# EAGLE design PennyMan_Ard_R3_Shield_v9.5 (EAGLE 9.1.3)
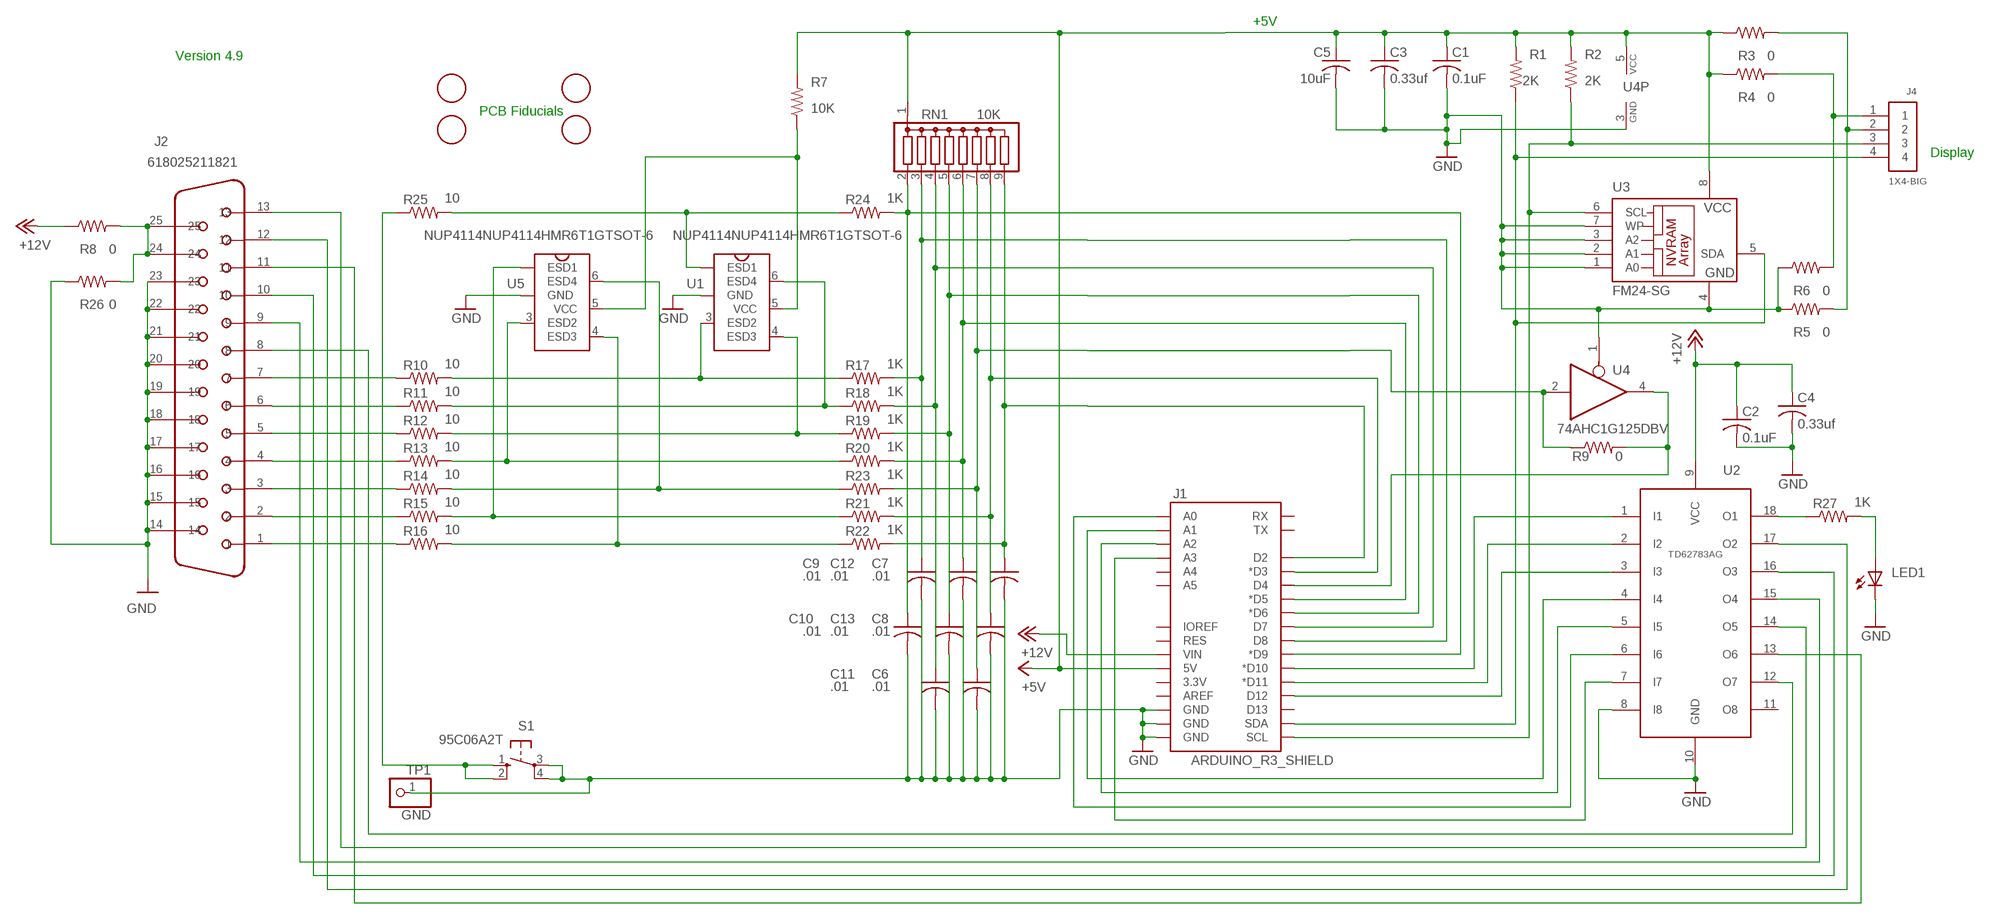
[diagram p0: schematic, sheet 1]

## Parts
C1  0.1uF  C-USC0805  [C0805]
C2  0.1uF  C-USC0805  [C0805]
C3  0.33uf  C-USC1206  [C1206]
C4  0.33uf  C-USC1206  [C1206]
C5  10uF  C-USC1812  [C1812]
C6  .01  C-USC0805  [C0805]
C7  .01  C-USC0805  [C0805]
C8  .01  C-USC0805  [C0805]
C9  .01  C-USC0805  [C0805]
C10  .01  C-USC0805  [C0805]
C11  .01  C-USC0805  [C0805]
C12  .01  C-USC0805  [C0805]
C13  .01  C-USC0805  [C0805]
GND  TP1  PINHD-1X1  [1X01]
J1  ARDUINO_R3_SHIELD  [UNO_R3_SHIELD]
J2  618025211821  [618025211821]
J4  1X4-BIG  [1X04-BIG]
LED1  LEDSMT1206  [1206]
R1  2K  R-US_R0805  [R0805]
R2  2K  R-US_R0805  [R0805]
R3  0  R-US_R0805  [R0805]
R4  0  R-US_R0805  [R0805]
R5  0  R-US_R0805  [R0805]
R6  0  R-US_R0805  [R0805]
R7  10K  R-US_R0805  [R0805]
R8  0  R-US_R0805  [R0805]
R9  0  R-US_R0805  [R0805]
R10  10  R-US_M0805  [M0805]
R11  10  R-US_M0805  [M0805]
R12  10  R-US_M0805  [M0805]
R13  10  R-US_M0805  [M0805]
R14  10  R-US_M0805  [M0805]
R15  10  R-US_M0805  [M0805]
R16  10  R-US_M0805  [M0805]
R17  1K  R-US_M0805  [M0805]
R18  1K  R-US_M0805  [M0805]
R19  1K  R-US_M0805  [M0805]
R20  1K  R-US_M0805  [M0805]
R21  1K  R-US_M0805  [M0805]
R22  1K  R-US_M0805  [M0805]
R23  1K  R-US_M0805  [M0805]
R24  1K  R-US_M0805  [M0805]
R25  10  R-US_M0805  [M0805]
R26  0  R-US_R0805  [R0805]
R27  1K  R-US_M0805  [M0805]
RN1  10K  G08R  [SIL9]
S1  95C06A2T  10-XX  [B3F-10XX]
U1  NUP4114NUP4114HMR6T1GTSOT-6  [TSOT-23-6]
U2  TD62783AG  [SOP18]
U3  FM24-SG  [SO8]
U4  74AHC1G125DBV  [SOT23-5]
U5  NUP4114NUP4114HMR6T1GTSOT-6  [TSOT-23-6]
U$1  FIDUCIAL  [FIDUCIAL_1MM]
U$2  FIDUCIAL  [FIDUCIAL_1MM]
U$3  FIDUCIAL  [FIDUCIAL_1MM]
U$4  FIDUCIAL  [FIDUCIAL_1MM]

## Nets
+5V: C1.1 C3.1 C5.1 J1.5V R1.2 R2.2 R3.1 R4.1 R7.2 RN1.1 U3.8(VCC) U4.5(VCC)
+12V: C2.1 C4.1 J1.VIN R8.1 U2.9(VCC)
GND: C1.2 C2.2 C3.2 C4.2 C5.2 C6.2 C7.2 C8.2 C9.2 C10.2 C11.2 C12.2 C13.2 GND.1 J1.GND@0(GND) J1.GND@1(GND) J1.GND@2(GND) J2.14 J2.15 J2.16 J2.17 J2.18 J2.19 J2.20 J2.21 J2.22 J2.23 LED1.C R5.1 R6.1 R26.1 S1.3(P) S1.4(P1) U1.2(GND) U2.8(I8) U2.10(GND) U3.1(A0) U3.2(A1) U3.3(A2) U3.4(GND) U3.7(WP) U4.1(OE) U4.3(GND) U5.2(GND)
N$1: C7.1 J1.D2 R22.2 RN1.9
N$2: C8.1 J1.D3(*D3) R21.2 RN1.8
N$3: C6.1 R9.1 R23.2 RN1.7 U4.2(I)
N$4: C9.1 J1.D5(*D5) R20.2 RN1.6
N$5: C10.1 J1.D6(*D6) R19.2 RN1.5
N$6: C11.1 J1.D7 R18.2 RN1.4
N$7: C12.1 J1.D8 R17.2 RN1.3
N$8: R24.1 R25.2 U1.1(ESD1)
N$9: R10.2 R17.1 U1.3(ESD2)
N$10: R11.2 R18.1 U1.6(ESD4)
N$11: R12.2 R19.1 U1.4(ESD3)
N$12: R13.2 R20.1 U5.3(ESD2)
N$13: R25.1 S1.1(S) S1.2(S1)
N$14: R14.2 R23.1 U5.6(ESD4)
N$15: R7.1 U1.5(VCC) U5.5(VCC)
N$16: R15.2 R21.1 U5.1(ESD1)
N$17: J1.A0 U2.6(I6)
N$18: J1.D10(*D10) U2.1(I1)
N$19: J1.D11(*D11) U2.2(I2)
N$20: J1.D12 U2.3(I3)
N$21: J1.A1 U2.4(I4)
N$22: J2.12 U2.17(O2)
N$23: J2.10 U2.16(O3)
N$24: J2.9 U2.15(O4)
N$25: R16.2 R22.1 U5.4(ESD3)
N$26: J1.SCL J4.3 R2.1 U3.6(SCL)
N$27: J2.13 U2.14(O5)
N$28: J4.1 R4.2 R6.2
N$29: J1.SDA J4.4 R1.1 U3.5(SDA)
N$30: J4.2 R3.2 R5.2
N$31: J1.D4 R9.2 U4.4(O)
N$32: J1.A2 U2.5(I5)
N$33: R27.1 U2.18(O1)
N$34: J2.11 U2.13(O6)
N$35: LED1.A R27.2
N$36: J1.A3 U2.7(I7)
N$37: J2.8 U2.12(O7)
N$38: J2.24 J2.25 R8.2 R26.2
N$39: J2.6 R11.1
N$42: J2.4 R13.1
N$44: J2.2 R15.1
N$46: J2.1 R16.1
N$48: J2.3 R14.1
N$50: J2.5 R12.1
N$52: J2.7 R10.1
N$53: C13.1 J1.D9(*D9) R24.2 RN1.2
Unconnected: J1.3.3V J1.A4 J1.A5 J1.AREF J1.D13 J1.IOREF J1.RES J1.RX J1.TX U2.11(O8)

## Notes on the sheet
- +5V
- Version 4.9
- PCB Fiducials
- Display

## Library data of the parts
C1-C5 = resistor:C-US: CAPACITOR, American symbol
C6-C13 = adafruit:C-US: CAPACITOR, American symbol
GND = adafruit:PINHD-1X1: Pin header 1x1 for 0.1" spacing With round pins
J1 = SparkFun-Boards:ARDUINO_R3_SHIELD: Shield form compatible with the Arduino Uno R3.
J2 = EagleLibrary_Wuerth_Elektronik_eiCan_Communication_Connectors_v4_20150113:618025211821: WR-DSUB 8.08mm Female Angled PCB Connector without Hex Screw, 25 Pins=>Code : Con_I-O_DSUB_PCB_Female_wo-screw_618025211821 <http://katalog.we-online.de/media/images/eican/Con_I-O_DSUB_PCB_Female_wo-screw_6180xx211821_pf2.jpg> Details see: http://katalog.we-online.de/en/em/618_0xx_211_821 Created 2014-07-10, Karrer Zheng 2014 (C) Würth Elektronik
J4 = adafruit:1X4: 4-pin connector
LED1 = adafruit:LED: LED OSRAM: - CHIPLED LG R971, LG N971, LY N971, LG Q971, LY Q971, LO R971, LY R971 LH N974, LH R974 LS Q976, LO Q976, LY Q976 LO Q996 - Hyper CHIPLED LW Q18S LB Q993, LB Q99A, LB R99A - SideLED LS A670, LO A670, LY A670, LG A670, LP A670 LB A673, LV A673, LT A673, LW A673 LH A674 LY A675 LS A676, LA A676, LO A676, LY A676, LW A676 LS A679, LY A679, LG A679 - Hyper Micro SIDELED® LS Y876, LA Y876, LO Y876, LY Y876 LT Y87S - SmartLED LW L88C, LW L88S LB L89C, LB L89S, LG L890 LS L89K, LO L89K, LY L89K LS L896, LA L896, LO L896, LY L896 - TOPLED LS T670, LO T670, LY T670, LG T670, LP T670 LSG T670, LSP T670, LSY T670, LOP T670, LYG T670 LG T671, LOG T671, LSG T671 LB T673, LV T673, LT T673, LW T673 LH T674 LS T676, LA T676, LO T676, LY T676, LB T676, LH T676, LSB T676, LW T676 LB T67C, LV T67C, LT T67C, LS T67K, LO T67K, LY T67K, LW E67C LS E67B, LA E67B, LO E67B, LY E67B, LB E67C, LV E67C, LT E67C LW T67C LS T679, LY T679, LG T679 LS T770, LO T770, LY T770, LG T770, LP T770 LB T773, LV T773, LT T773, LW T773 LH T774 LS E675, LA E675, LY E675, LS T675 LS T776, LA T776, LO T776, LY T776, LB T776 LHGB T686 LT T68C, LB T68C - Hyper Mini TOPLED® LB M676 - Mini TOPLED Santana® LG M470 LS M47K, LO M47K, LY M47K Source: http://www.osram.convergy.de/
R1-R27 = resistor:R-US_: RESISTOR, American symbol
RN1 = resistor-sil:G08R: SIL RESISTOR; OC_FARNELL: unknown; OC_NEWARK: unknown
S1 = switch-omron:10-XX: OMRON SWITCH
U1 U5 = TSOT-23-6:NUP4114: On Semiconductor ESD Diode Array - Quad
U2 = NDN:TD62783AG: Octal High-side driver
U3 = ramtron:FM24*: I2C NVRAM 8 pin
U4 = 74xx-little-us:74*1G125: Single Bus Buffer Gate with 3-State Output
U$1-U$4 = adafruit:FIDUCIAL: For use by pick and place machines to calibrate the vision/machine, 1mm By microbuilder.eu

## Net classes
0 default: clearance 0.205 mm

## Board
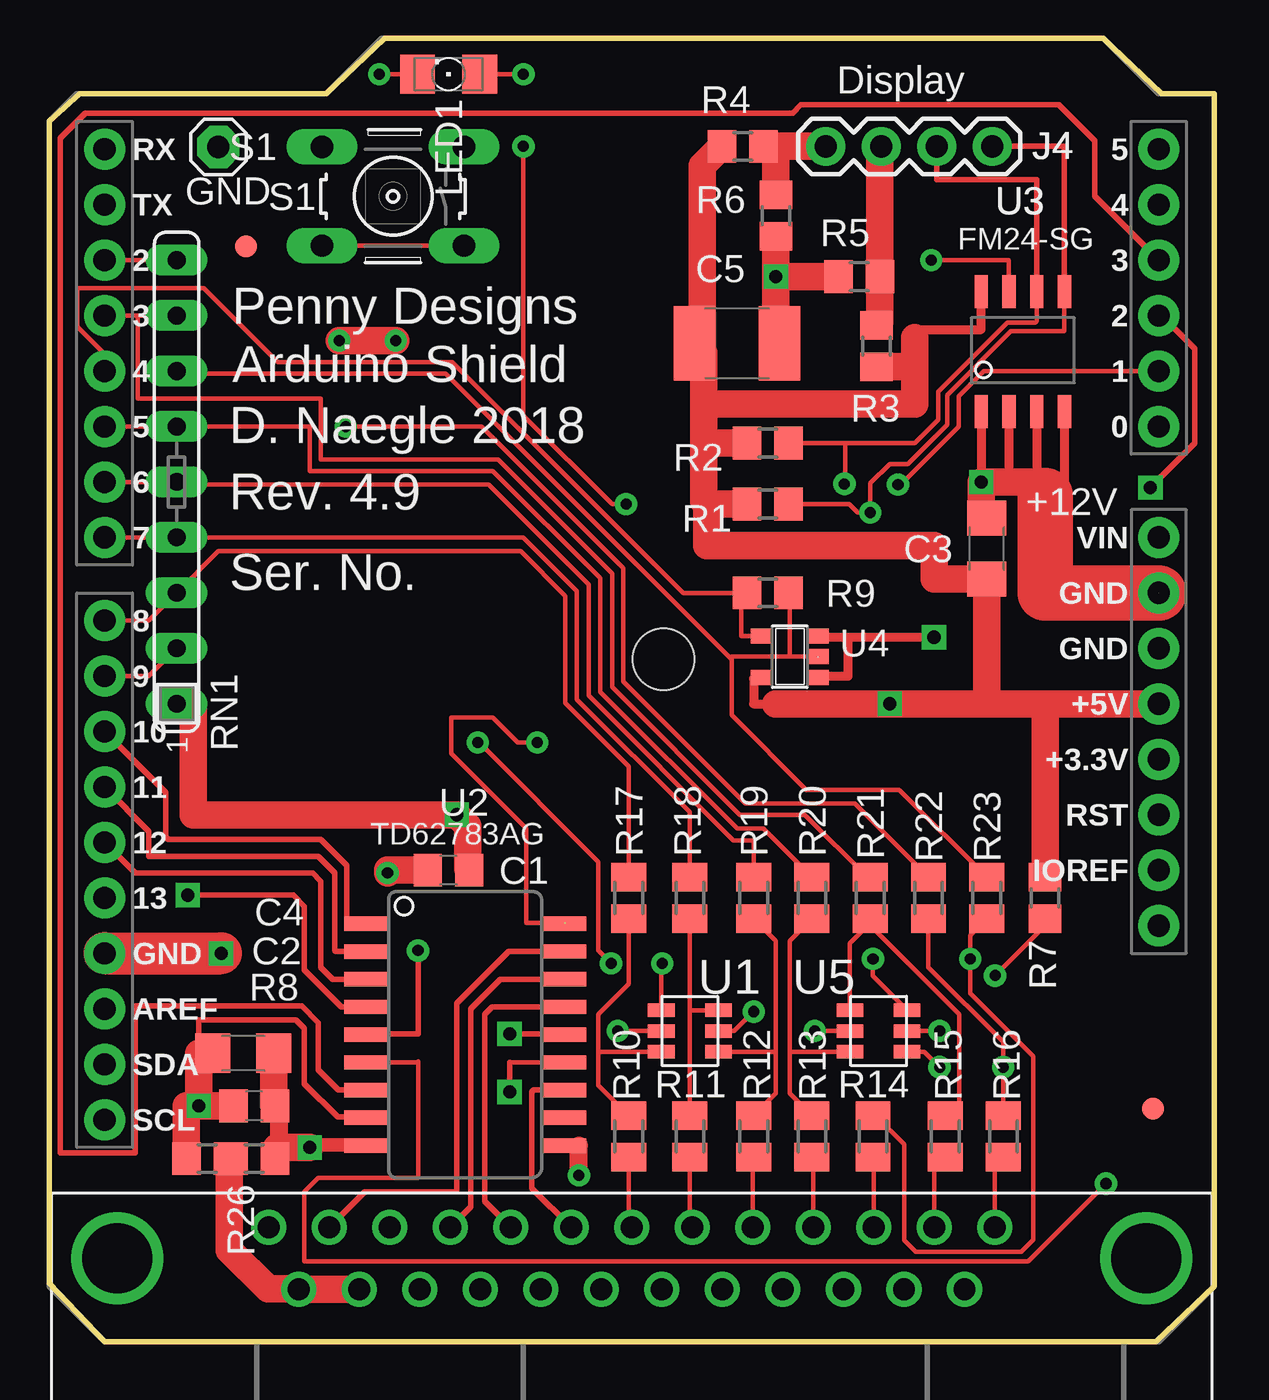
[diagram p1: board, top side]
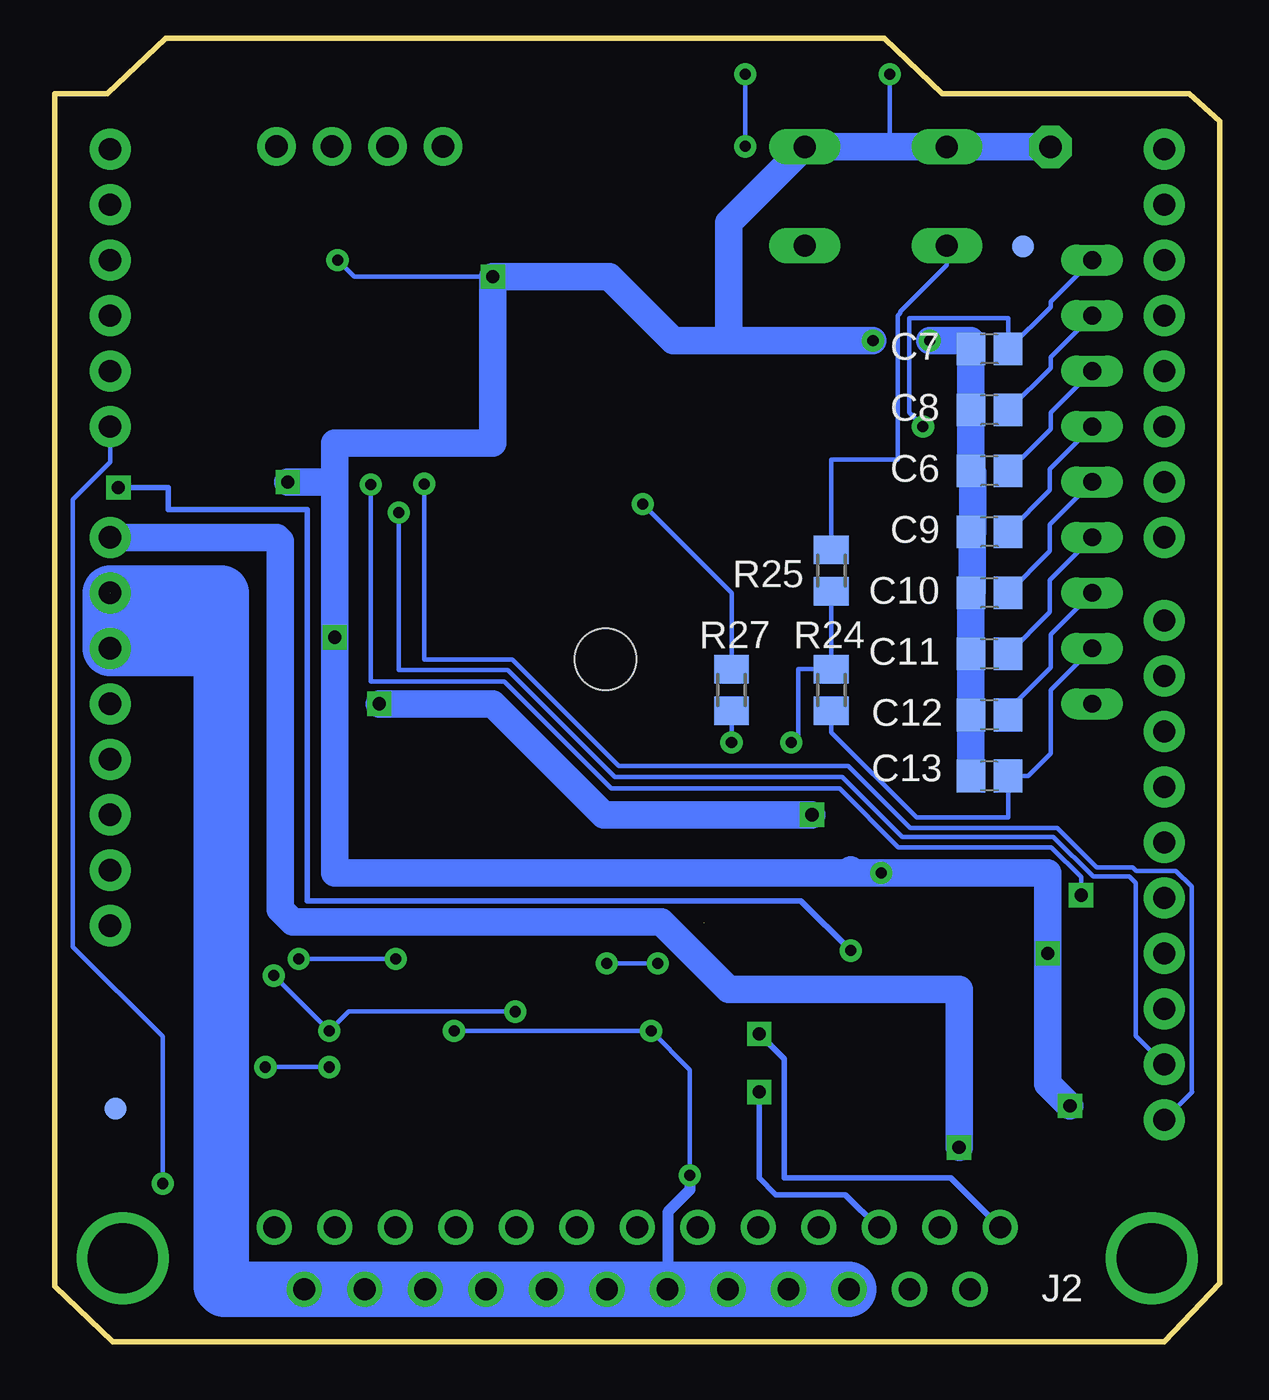
[diagram p2: board, bottom side, seen from below]

No outline drawn. Coordinates in mm, seen from the top.
Copper layers (1*16): Top 0.035mm / dielectric 1.5mm / Bottom 0.035mm
Design rules "SparkFun *": minimum track width 8mil, minimum drill 20mil, track to track 8mil, track to pad 8mil, pad to pad 8mil, via to via 8mil, smd to smd 8mil, copper to edge 10mil, drill to drill 8mil, minimum pad ring 12mil, minimum via ring 10mil, stop-mask expansion 0mil, vias tented up to drill 25mil, thermal gap 10mil
Holes 2.8 mm at 28,31.25

### Footprints (pad centres in the part's own frame; a part is rotated, then mirrored left to right if it is on the bottom)
C0805 = smd 1.3 x 1.5: 1 -0.95,0; 2 0.95,0
C1206 = smd 1.6 x 1.8: 1 -1.4,0; 2 1.4,0
C1812 = smd 1.9 x 3.4: 1 -1.95,0; 2 1.95,0
C0805' = smd 1.3 x 1.5: 1 -0.85,0; 2 0.85,0
1X01 = drill 1.016 pad 1.93 octagon: 1 0,0
UNO_R3_SHIELD = drill 1.016 pad 1.88: 3.3V 50.8,26.67; 5V 50.8,29.21; A0 50.8,41.91; A1 50.8,44.45; A2 50.8,46.99; A3 50.8,49.53; A4 50.8,52.07; A5 50.8,54.61; AREF 2.54,15.24; D2 2.54,49.53; D3 2.54,46.99; D4 2.54,44.45; D5 2.54,41.91; D6 2.54,39.37; D7 2.54,36.83; D8 2.54,33.02; D9 2.54,30.48; D10 2.54,27.94; D11 2.54,25.4; D12 2.54,22.86; D13 2.54,20.32; GND@0 50.8,31.75; GND@1 50.8,34.29; GND@2 2.54,17.78; IOREF 50.8,21.59; NC 50.8,19.05; RES 50.8,24.13; RX 2.54,54.61; SCL 2.54,10.16; SDA 2.54,12.7; TX 2.54,52.07; VIN 50.8,36.83
618025211821 = drill 1: 1 16.62,1.42; 2 13.85,1.42; 3 11.08,1.42; 4 8.31,1.42; 5 5.54,1.42; 6 2.77,1.42; 7 0,1.42; 8 -2.77,1.42; 9 -5.54,1.42; 10 -8.31,1.42; 11 -11.08,1.42; 12 -13.85,1.42; 13 -16.62,1.42; 14 15.235,-1.42; 15 12.465,-1.42; 16 9.695,-1.42; 17 6.925,-1.42; 18 4.155,-1.42; 19 1.385,-1.42; 20 -1.385,-1.42; 21 -4.155,-1.42; 22 -6.925,-1.42; 23 -9.695,-1.42; 24 -12.465,-1.42; 25 -15.235,-1.42 | drill 3.2: Z1 -23.55,0; Z2 23.55,0
1X04-BIG = drill 1.016 pad 1.778: 1 0,0; 2 2.54,0; 3 5.08,0; 4 7.62,0
1206 = smd 1.6 x 1.803: A -1.422,0; C 1.422,0
R0805 = smd 1.3 x 1.5: 1 -0.95,0; 2 0.95,0
M0805 = smd 1.3 x 1.6: 1 -0.95,0; 2 0.95,0
SIL9 = drill 0.813 long: 1 -10.16,0; 2 -7.62,0; 3 -5.08,0; 4 -2.54,0; 5 0,0; 6 2.54,0; 7 5.08,0; 8 7.62,0; 9 10.16,0
B3F-10XX = drill 1.016 long: 1 -3.251,2.261; 2 3.251,2.261; 3 -3.251,-2.261; 4 3.251,-2.261
TSOT-23-6 = smd 0.622 x 1.22: 1 -0.95,-1.31; 2 0,-1.31; 3 0.95,-1.31; 4 0.95,1.31; 5 0,1.31; 6 -0.95,1.31
SOP18 = smd 0.66 x 2.032: 1 -3.9,-4.525; 2 -2.625,-4.525; 3 -1.36,-4.525; 4 -0.09,-4.525; 5 1.18,-4.525; 6 2.45,-4.525; 7 3.72,-4.525; 8 4.99,-4.525; 9 6.26,-4.525; 10 6.26,4.525; 11 4.99,4.525; 12 3.72,4.525; 13 2.45,4.525; 14 1.18,4.525; 15 -0.09,4.525; 16 -1.36,4.525; 17 -2.63,4.525; 18 -3.9,4.525
SO8 = smd 0.61 x 1.524: 1 -1.27,-2.743; 2 0,-2.743; 3 1.27,-2.743; 4 2.54,-2.743; 5 2.54,2.743; 6 1.27,2.743; 7 0,2.743; 8 -1.27,2.743
SOT23-5 = smd 0.69 x 0.99: 1 -0.95,-1.29; 2 0,-1.29; 3 0.95,-1.29; 4 0.95,1.3; 5 -0.95,1.3
FIDUCIAL_1MM = smd 1 x 1: 1 0,0

### Placement (x,y rotation side)
C1  18.16,21.59 180 top
C2  9.27,10.79 180 top
C3  42.8,36.32 90 top
C4  8.76,13.21 180 top
C5  31.37,45.72 0 top
C6  .01  [C0805']  10.41,39.88 180 bottom
C7  .01  [C0805']  10.41,45.47 180 bottom
C8  .01  [C0805']  10.41,42.67 180 bottom
C9  .01  [C0805']  10.41,37.08 180 bottom
C10  .01  [C0805']  10.41,34.29 180 bottom
C11  .01  [C0805']  10.41,31.5 180 bottom
C12  .01  [C0805']  10.41,28.7 180 bottom
C13  .01  [C0805']  10.41,25.91 180 bottom
GND  7.62,54.71 0 top
J1  -0.13,0 0 top
J2  26.54,3.81 0 top
J4  35.43,54.74 0 top
LED1  18.16,58.04 180 top
R1  32.77,38.35 180 top
R2  32.77,41.15 180 top
R3  37.75,45.59 90 top
R4  31.62,54.74 0 top
R5  36.96,48.77 0 top
R6  33.15,51.56 90 top
R7  45.47,20.32 90 top
R8  9.27,8.38 180 top
R9  32.77,34.29 180 top
R10  26.42,9.4 90 top
R11  29.21,9.4 90 top
R12  32.13,9.4 90 top
R13  34.8,9.4 90 top
R14  37.59,9.4 90 top
R15  40.89,9.4 90 top
R16  43.56,9.4 90 top
R17  26.42,20.32 90 top
R18  29.21,20.32 90 top
R19  32.13,20.32 90 top
R20  34.8,20.32 90 top
R21  37.47,20.32 90 top
R22  40.13,20.32 90 top
R23  42.8,20.32 90 top
R24  17.65,29.84 270 bottom
R25  17.65,35.31 270 bottom
R26  7.11,8.38 0 top
R27  22.23,29.84 90 bottom
RN1  5.71,39.37 90 top
S1  15.62,52.45 180 top
U1  29.21,14.22 270 top
U2  18.92,15.24 270 top
U3  43.81,45.34 0 top
U4  33.78,31.37 90 top
U5  37.85,14.22 270 top
U$1  50.42,10.67 0 top
U$2  8.89,50.16 0 top
U$3  50.42,10.67 0 bottom
U$4  8.89,50.16 0 bottom

### Tracks (layer width: path | path; a pad name or v marks a point on that pad's centre or on a via)
+5V  (via drill 0.6)
  Top 0.203: 45.47,29.08 45.59,29.21
  Top 0.254: 39.55,46.35 39.55,46.02 39.5,45.97 | 32.13,30.35 32.48,30.35 | 30.61,38.35 29.97,38.35
  Top 0.406: 39.55,46.35 42.55,46.35 U3.8 | 32.13,30.35 32.13,29.21 33.15,29.21 | 32.48,30.35 U4.5
  Top 1.27: J1.5V 45.59,29.21 42.8,29.21 | 42.8,29.21 C3.1 40.39,34.92 40.39,36.45 29.97,36.45 29.97,38.35 29.84,38.48 29.84,41.15 | 42.8,29.21 v38.35,29.21 33.15,29.21 | 39.5,45.97 39.5,44.58 | 39.5,44.58 39.5,42.93 29.97,42.93 29.84,43.05 | R1.2 30.61,38.35 | R3.1 39.43,44.64 39.5,44.58 | RN1.1 6.22,29.21 arc-90 6.48,28.96 6.48,24.13 v18.54,24.13 19.05,23.62 19.05,21.65 C1.1 | R7.2 45.47,25.91 | 45.47,25.91 45.47,29.08 | 45.47,25.91 | R4.1 29.78,53.85 29.78,45.72 C5.1 29.84,45.29 29.84,43.05 | 29.84,43.05 29.84,41.15 | 29.84,41.15 R2.2
  Bottom 1.27: v38.35,29.21 33.15,29.21 28.07,24.13 v18.54,24.13
+12V  (via drill 0.6)
  Top 0.254: 14.4,9.02 U2.9 | R8.1 10.29,8.45 10.29,8.89
  Top 0.61: 14.4,9.02 11.94,9.02 v11.81,8.89
  Top 0.813: 11.94,9.02 10.41,9.02 10.41,10.79 C2.1
  Top 1.27: 10.29,8.89 v11.81,8.89 | C2.1 10.16,10.79 C4.1
  Bottom 1.27: J1.VIN 43.05,36.83 42.88,36.65 42.88,19.79 42.31,19.23 25.45,19.23 22.35,16.13 11.81,16.13 v11.81,8.89
GND  (via drill 0.51, 0.6)  (1 unrouted)
  Top 0.203: U1.2 v25.91,14.22 | U5.2 v34.92,14.22 | U3.7 43.81,49.53 v40.26,49.53 | LED1.C v14.99,58.04
  Top 0.254: 14.36,10.29 13.08,10.29 11.56,11.81 11.56,14.35 11.18,14.73 6.73,14.73 6.73,13.21 | 35.31,32.26 35.07,32.26 U4.3 | U4.1 34.99,30.42 arc90 35.05,30.48
  Top 0.406: U3.1 v42.55,39.37 | U3.2 43.81,39.37 | U3.3 45.09,39.37 | U3.4 46.35,39.37 45.47,39.37 | 35.31,32.26 36.45,32.26 | 36.45,32.26 v40.39,32.26 | 35.05,30.48 36.45,30.48 36.45,32.26
  Top 0.61: U2.10 24.13,8.98
  Top 0.635: U2.8 14.36,10.29
  Top 0.813: v24.13,7.62 24.13,8.98
  Top 1.27: C3.2 42.54,37.72 v42.54,39.37 v42.55,39.37 43.81,39.37 45.09,39.37 45.47,39.37 45.47,38.73 | R6.1 v33.15,48.77 | v33.15,48.77 R5.1 | C5.2 33.15,45.72 v33.15,48.77 | v6.73,10.79 6.73,13.21 C4.2 | v15.75,45.85 v13.15,45.85 | C1.2 15.37,21.59 v15.37,21.46 | v6.73,10.79 C2.2 | R26.1 6.16,10.79 v6.73,10.79
  Top 1.93: J1.GND@2 v7.75,17.78
  Top 2.54: J1.GND@1 48.26,34.29 45.47,34.29 45.47,38.73
  Bottom 0.203: C9.2 11.18,37.08 | v24.13,7.62 24.13,12.45 v25.91,14.22 29.34,14.22 | v34.92,14.22 29.34,14.22 | 29.34,14.22 | 29.34,14.22 | 29.34,14.22 | 29.34,14.22 | 29.34,14.22 | 29.34,14.22 | v40.26,49.53 39.5,48.77 v33.15,48.77 | v14.99,58.04 14.99,54.71 S1.4
  Bottom 0.406: 45.44,2.39 45.59,2.54
  Bottom 0.508: v24.13,7.62 24.13,6.95 25.14,5.94 25.14,2.41 J2.20
  Bottom 1.27: 40.39,39.37 v40.39,32.26 40.39,21.46 23.5,21.46 16.89,21.46 16.76,21.59 16.64,21.46 v15.37,21.46 7.75,21.46 v7.75,17.78 7.75,11.81 v6.73,10.79 | 40.39,39.37 40.39,41.15 33.15,41.15 v33.15,48.77 27.81,48.77 24.89,45.85 22.35,45.85 | 40.39,39.37 v42.54,39.37 | 11.18,37.08 11.18,39.79 C6.2 C8.2 C7.2 11.26,45.85 v13.15,45.85 | C13.2 C12.2 C11.2 C10.2 11.2,34.35 11.2,37.08 C9.2 | 22.35,45.85 v15.75,45.85 | GND.1 14.99,54.71 S1.3 22.35,51.23 22.35,46.99 22.35,45.85
  Bottom 2.54: 45.59,31.75 J1.GND@0 J1.GND@1 45.59,34.29 45.59,31.75 | J2.23 J2.22 J2.21 J2.20 J2.19 J2.18 J2.17 J2.16 36.33,2.39 37.22,2.39 J2.15 39.19,2.39 J2.14 45.44,2.39 | 45.59,2.54 45.59,31.75
N$1  (via drill 0.51)
  Top 0.203: R22.2 36.76,24.64 31.75,24.64 26.16,30.23 26.16,35.43 19.68,41.91 14.1,41.91 14.48,41.91 v13.46,41.91 | J1.D2 RN1.9
  Bottom 0.203: v13.46,41.91 14.1,42.55 14.1,46.86 9.56,46.86 C7.1 9.53,45.47 7.62,47.37 7.62,47.62 RN1.9
N$2
  Top 0.203: RN1.8 3.94,46.99 | 3.94,46.99 J1.D3 | 3.94,46.99 3.94,43.18 12.32,43.18 12.32,40.39 20.45,40.39 25.65,35.18 25.65,29.97 31.5,24.13 34.48,24.13 37.34,21.27 R21.2
  Bottom 0.203: C8.1 9.53,42.67 7.62,44.58 7.62,45.09 RN1.8
N$3
  Top 0.203: U4.2 33.78,31.37 | 33.78,31.37 33.78,34.22 R9.1 | R23.2 38.8,25.27 34.54,25.27 31.11,28.7 31.11,31.24 | 31.11,31.24 31.11,31.37 31.24,31.37 33.78,31.37 | 31.11,31.24 18.03,44.32 10.54,44.32 5.84,44.32 RN1.7
  Bottom 0.203: C6.1 9.53,39.88 7.62,41.78 7.62,42.55 RN1.7
N$4
  Top 0.203: J1.D5 RN1.6 11.81,41.91 11.81,39.88 20.19,39.88 25.11,34.96 25.11,29.75 31.37,23.5 31.62,23.5 32.57,23.5 R20.2
  Bottom 0.203: RN1.6 7.66,39.97 7.66,38.99 C9.1
N$5
  Top 0.203: J1.D6 RN1.5 5.84,39.24 20,39.24 24.58,34.66 24.58,29.58 31.2,22.96 32.13,22.96 R19.2
  Bottom 0.203: RN1.5 7.66,37.43 7.66,36.2 C10.1
N$6
  Top 0.203: RN1.4 J1.D7 21.58,36.83 24.04,34.37 24.04,29.41 29.21,24.25 R18.2
  Bottom 0.203: RN1.4 7.66,34.89 7.66,33.4 C11.1
N$7
  Top 0.203: J1.D8 4.45,33.02 RN1.3 7.62,36.2 21.46,36.2 23.51,34.15 23.51,29.25 26.42,26.34 R17.2
  Bottom 0.203: C12.1 9.56,28.92 7.62,30.86 7.62,32.38 RN1.3
N$8  (via drill 0.51)
  Top 0.203: U1.1 27.9,17.32 v27.94,17.32 | v25.6,17.32 25.02,17.91 25.02,21.97 19.56,27.43 v19.49,27.43
  Bottom 0.203: v27.94,17.32 v25.6,17.32 | R25.2 R24.1 19.18,30.8 19.18,27.75 v19.49,27.43
N$9
  Top 0.203: 25.02,13.21 25.02,11.74 R10.2 | 25.02,13.21 25.02,14.99 26.42,16.38 R17.1 | U1.3 25.09,13.27 25.02,13.21
N$10
  Top 0.203: R11.2 29.21,13.34 29.21,15.11 | 29.21,15.11 R18.1 | U1.6 29.27,15.17 29.21,15.11
N$11
  Top 0.203: 33.15,13.34 33.15,11.36 R12.2 | 33.15,13.34 33.15,18.35 R19.1 | U1.4 33.09,13.27 33.15,13.34
N$12
  Top 0.203: 33.78,13.34 33.78,11.36 R13.2 | 33.78,13.34 33.78,15.11 33.78,18.35 R20.1 | U5.3 33.84,13.27 33.78,13.34
N$13
  Top 0.203: S1.2 S1.1
  Bottom 0.203: R25.1 17.65,40.39 14.61,40.39 14.61,46.99 14.51,47.09 14.51,47.16 13.31,48.36 12.37,49.29 S1.2
N$14  (via drill 0.51)
  Top 0.203: R14.2 37.7,10.35 39.03,9.03 39.03,4.64 39.55,4.12 44.38,4.12 44.92,4.66 44.92,13.06 42.04,15.94 v42.04,17.53 42.04,18.61 R23.1 | U5.6 37.59,16.74 v37.59,17.53
  Bottom 0.203: v37.59,17.53 v42.04,17.53
N$15  (via drill 0.51)
  Top 0.203: v43.18,16.76 45.47,19.05 R7.1 | U5.5 v40.64,14.22 | v32.13,15.11 31.24,14.22 U1.5
  Bottom 0.203: v43.18,16.76 v40.64,14.22 39.75,15.11 v32.13,15.11
N$16
  Top 0.203: 37.47,19.18 37.47,19.05 41.53,14.99 41.53,11.68 41.53,10.98 R15.2 | 37.47,19.18 R21.1 | U5.1 36.54,18.25 37.47,19.18
N$17  (via drill 0.51)
  Top 0.203: U2.6 16.73,12.79 16.76,12.83 16.76,7.49 12.19,7.49 11.56,6.86 11.56,3.68 44.7,3.68 v48.26,7.24
  Bottom 0.203: J1.A0 50.67,40.28 52.38,38.57 52.38,29.15 52.38,18.09 48.26,13.97 v48.26,7.24
N$18
  Top 0.254: J1.D10 5.21,25.15 5.21,23.11 5.33,22.99 12.32,22.99 13.51,21.8 13.51,19.14 U2.1
N$19
  Top 0.254: J1.D11 4.45,23.37 4.45,22.23 12.19,22.23 12.95,21.46 12.95,17.91 13,17.86 U2.2
N$20
  Top 0.254: U2.3 12.86,16.6 12.32,17.14 12.32,21.08 11.94,21.46 3.81,21.46 J1.D12
N$21  (via drill 0.51, 0.6)
  Top 0.203: J1.A1 42.67,44.45 41.52,43.3 41.52,41.9 38.86,39.24 v38.73,39.24
  Top 0.254: v6.22,20.45 11.05,20.45 11.56,19.94 11.56,17.02 13.24,15.33 U2.4
  Bottom 0.203: v38.73,39.24 38.73,30.23 32.64,30.23 27.74,25.33 17.27,25.33 14.59,22.64 7.58,22.64 6.22,21.28 v6.22,20.45
N$22
  Top 0.254: U2.17 20.92,17.87 18.54,15.49 18.54,6.86 14.32,6.86 J2.12
N$23
  Top 0.254: U2.16 20.54,16.6 19.18,15.24 19.18,6.17 J2.10
N$24
  Top 0.254: J2.9 19.81,6.42 19.81,14.99 20.16,15.33 U2.15
N$25  (via drill 0.51)
  Top 0.203: R16.2 v43.56,12.57 43.56,13.72 40.13,17.14 R22.1 | v40.64,12.57 39.94,13.27 U5.4
  Bottom 0.203: v43.56,12.57 v40.64,12.57
N$26  (via drill 0.51)
  Top 0.203: U3.6 45.09,46.74 45.02,46.67 43.73,46.67 40.58,43.51 40.58,42.23 39.5,41.15 R2.1 36.32,41.15 36.32,39.24 36.32,39.28 v36.28,39.28
  Top 0.254: J4.3 40.51,53.21 45.09,53.21 U3.6
  Bottom 0.203: v36.28,39.28 36.28,31.24 32.26,31.24 27.39,26.37 16.89,26.37 14.05,23.53 7.32,23.53 5.5,21.72 3.85,21.72 3.7,21.57 1.9,21.57 1.17,20.84 1.17,11.45 1.14,11.43 J1.SCL
N$27  (via drill 0.6)
  Top 0.254: U2.14 23.48,14.1 v20.95,14.1
  Bottom 0.254: v20.95,14.1 19.81,12.95 19.81,7.49 12.19,7.49 J2.13
N$28
  Top 1.27: J4.1 R4.2 33.15,54.74 R6.2
N$29  (via drill 0.51)
  Top 0.203: U3.5 46.35,46.27 43.9,46.27 40.98,43.34 40.98,41.99 39.19,40.2 38.35,40.2 37.47,39.31 v37.47,37.97 36.89,37.97 36.51,38.35 R1.1
  Top 0.254: U3.5 46.35,54.74 J4.4
  Bottom 0.203: J1.SDA 3.71,14 3.71,21 4.02,21.31 5.67,21.31 7.49,23.12 14.41,23.12 17.14,25.86 21.29,25.86 27.57,25.86 32.47,30.76 37.47,30.76 v37.47,37.97
N$30
  Top 1.27: J4.2 37.91,54.74 R5.2 37.91,46.7 R3.2
N$31
  Top 0.203: J1.D4 2.41,45.23 1.17,46.47 1.17,48.24 6.96,48.24 10.34,44.86 18.33,44.86 28.9,34.29 R9.2 31.56,34.04 31.56,32.32 U4.4
N$32  (via drill 0.51, 0.6)
  Top 0.254: J1.A2 50.8,46.99 52.32,45.47 52.32,41.15 v50.29,39.12 | v16.76,17.91 16.76,14.1 14.4,14.1 U2.5
  Bottom 0.254: v50.29,39.12 48.01,39.12 48.01,38.1 41.66,38.1 41.66,20.19 19.05,20.19 v16.76,17.91
N$33  (via drill 0.51)  (1 unrouted)
  Top 0.203: v22.23,27.44 21.33,27.44 20.19,28.57 18.29,28.57 18.29,26.92 21.72,23.5 21.72,19.18 22.86,19.18 U2.18 23.48,19.18
  Bottom 0.203: v22.23,27.44 R27.1
N$34  (via drill 0.6)
  Top 0.203: U2.13 20.95,12.79
  Top 0.254: 20.95,12.79 v20.95,11.43
  Bottom 0.254: J2.11 15.52,5.23 17.02,6.73 20.19,6.73 20.95,7.49 v20.95,11.43
N$35  (via drill 0.51)
  Top 0.203: v21.59,54.74 21.59,42.42 25.65,38.35 v26.29,38.35 | LED1.A v21.59,58.04
  Bottom 0.203: R27.2 22.23,34.29 v26.29,38.35 | v21.59,58.04 v21.59,54.74
N$36
  Top 0.254: J1.A3 47.75,52.45 47.75,54.99 46.1,56.64 34.29,56.64 33.91,56.26 1.52,56.26 0.38,55.12 0.38,8.64 3.81,8.64 3.81,15.37 11.43,15.37 12.19,14.61 12.19,12.45 13.12,11.52 U2.7
N$37
  Top 0.254: U2.12 22.06,11.52 21.97,11.43 21.97,7.03 J2.8
N$38
  Top 1.27: J2.24 J2.25 11.29,2.41 9.91,2.41 8.13,4.19 8.13,8.38 R8.2 R26.2
N$39
  Top 0.203: J2.6 29.21,5.33 R11.1
N$42
  Top 0.203: J2.4 34.85,8.39 R13.1
N$44
  Top 0.203: J2.2 40.39,7.95 R15.1
N$46
  Top 0.203: J2.1 43.16,8.05 R16.1
N$48
  Top 0.203: J2.3 37.62,8.42 R14.1
N$50
  Top 0.203: J2.5 32.08,8.4 R12.1
N$52
  Top 0.203: J2.7 26.42,5.36 R10.1
N$53
  Top 0.203: RN1.2 4.45,30.48 J1.D9
  Bottom 0.203: R24.2 17.65,27.9 13.76,24 9.56,24 C13.1 8.64,25.91 7.62,26.92 7.62,29.84 RN1.2

### Text on the board
tPlace: Display | GND | Penny Designs | Arduino Shield | D. Naegle 2018 | Rev. 4.9 | +12V | Ser. No.
_tPlace: J4 | J4 | J4 | J4 | S1 | U3 | U3 | U3 | U3 | R3